# Altium schematic sheet SD_CARD_SDIO.SchDoc
size 209 x 297 mm; SheetNumber: 19; SheetTotal: 23
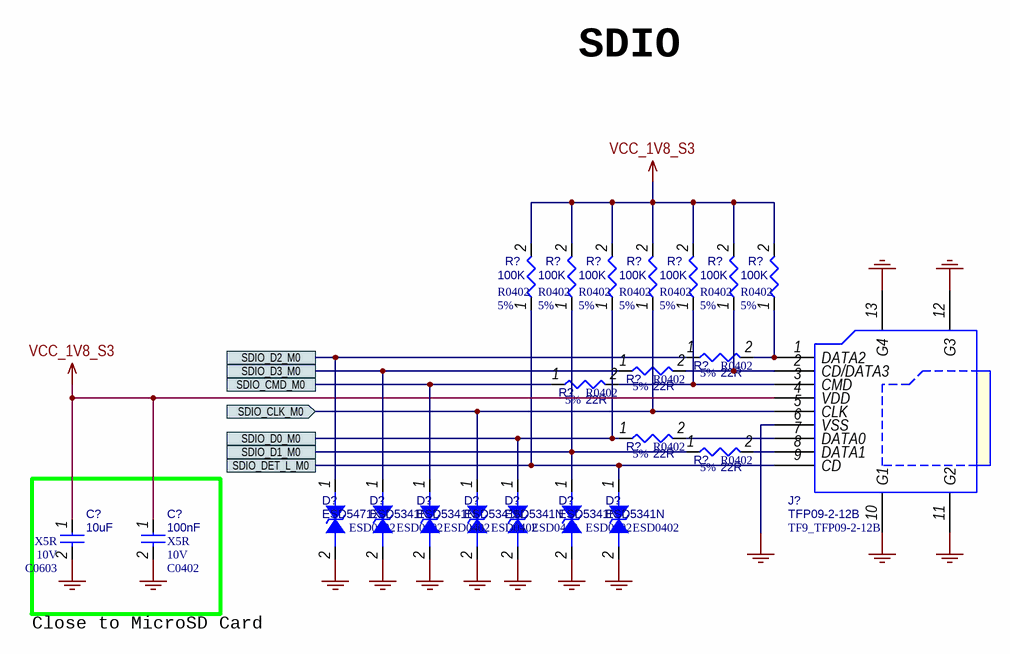
[diagram p0: SD_CARD_SDIO.SchDoc]

## Parts
(Parts that share a designator on the sheet are numbered #1, #2 ... from top to bottom, then left to right.)
C?#1  10uF  Dielectric: X5R  Voltage: 10V  [C0603]
C?#2  100nF  Dielectric: X5R  Voltage: 10V  [C0402]
D?#1  ESD5471X  [ESD0402]
D?#2  ESD5341N  [ESD0402]
D?#3  ESD5341N  [ESD0402]
D?#4  ESD5341N  [ESD0402]
D?#5  ESD5341N  [ESD0402]
D?#6  ESD5341N  [ESD0402]
D?#7  ESD5341N  [ESD0402]
J?  TFP09-2-12B  PCB Footprint: TF9_TFP09-2-12B  [TF-CKT01-009D]
R?#1  100K  Tolerance: 5%  [R0402]
R?#2  100K  Tolerance: 5%  [R0402]
R?#3  100K  Tolerance: 5%  [R0402]
R?#4  100K  Tolerance: 5%  [R0402]
R?#5  100K  Tolerance: 5%  [R0402]
R?#6  100K  Tolerance: 5%  [R0402]
R?#7  100K  Tolerance: 5%  [R0402]
R?#8  22R  Tolerance: 5%  [R0402]
R?#9  22R  Tolerance: 5%  [R0402]
R?#10  22R  Tolerance: 5%  [R0402]
R?#11  22R  Tolerance: 5%  [R0402]
R?#12  22R  Tolerance: 5%  [R0402]

## Ports
SDIO_CLK_M0 (in, see RK3588_BOOTLOADER_MAYBE_SDIO[2C]), SDIO_CMD_M0 (see RK3588_BOOTLOADER_MAYBE_SDIO[2C]), SDIO_D0_M0 (see RK3588_BOOTLOADER_MAYBE_SDIO[2C]), SDIO_D1_M0 (see RK3588_BOOTLOADER_MAYBE_SDIO[2C]), SDIO_D2_M0 (see RK3588_BOOTLOADER_MAYBE_SDIO[2C]), SDIO_D3_M0 (see RK3588_BOOTLOADER_MAYBE_SDIO[2C]), SDIO_DET_L_M0 (see RK3588_BOOTLOADER_MAYBE_SDIO[2C])

## Nets
GND: C?#1.2 C?#2.2 D?#1.2 D?#2.2 D?#3.2 D?#4.2 D?#5.2 D?#6.2 D?#7.2 J?.6(VSS) J?.10(G1) J?.11(G2) J?.12(G3) J?.13(G4)
VCC_1V8_S3: C?#1.1 C?#2.1 J?.4(VDD) R?#1.2 R?#2.2 R?#3.2 R?#4.2 R?#5.2 R?#6.2 R?#7.2
SDIO_CLK_M0: D?#4.1 J?.5(CLK) R?#4.1 ; port SDIO_CLK_M0
SDIO_CMD_M0: D?#3.1 R?#10.1 ; port SDIO_CMD_M0
SDIO_D0_M0: D?#5.1 R?#3.1 R?#11.1 ; port SDIO_D0_M0
SDIO_D1_M0: D?#6.1 R?#2.1 R?#12.1 ; port SDIO_D1_M0
SDIO_D2_M0: D?#1.1 R?#8.1 ; port SDIO_D2_M0
SDIO_D3_M0: D?#2.1 R?#9.1 ; port SDIO_D3_M0
SDIO_DET_L_M0: D?#7.1 J?.9(CD) R?#1.1 ; port SDIO_DET_L_M0
NetJ?_1: J?.1(DATA2) R?#7.1 R?#8.2
NetJ?_2: J?.2(CD/DATA3) R?#6.1 R?#9.2
NetJ?_3: J?.3(CMD) R?#5.1 R?#10.2
NetJ?_7: J?.7(DATA0) R?#11.2
NetJ?_8: J?.8(DATA1) R?#12.2

## Notes on the sheet
- SDIO
- Close to MicroSD Card
- 297x210
- Формат А4

## Library data of the parts
C?#1 = CAP NP_Dup1: cap,10.00uF,+/-10%,10V,X5R,C0603; Part Reference: C4201; Manufacturer PN: C1608X5R1A106K080AC; Manufacturer: TDK; Tolerance: 10%; C_Voltage: 6.3V; Priority: A; PCB Footprint: C0603; Value: 10uF; Created by: JJJ; Part Type: C0603; RK PN: C1608X5R1A106K080AC
C?#2 = CAP NP_Dup1: cap,100.00nF,+/-10%,10V,X5R,C0402; Part Reference: C4202; Manufacturer PN: C1005X5R1A104K050BA; Manufacturer: TDK; C_Voltage: 6.3V; Tolerance: 10%; Priority: A; Number: 37; PCB Footprint: C0402; Value: 100nF; Created by: JJJ; Part Type: C0402; RK PN: C1005X5R1A104K050BA
D?#1 = DIODE BI_DIR TRIG: 1-Line, Bi-directional, Transient Voltage Suppressors.9pF.; Part Reference: D4201; Manufacturer: WillSemi(О¤¶ы°лµјМе); Priority: A; PCB Footprint: ESD0402; Value: ESD5471X; Created by: JJJ; Manufacturer PN: ESD5471X; Part Type: ESD_TVS; RK PN: ESD5471X
D?#2 = DIODE BI_DIR TRIG: 1-Line, Bi-directional, Transient Voltage Suppressors.1pF.; Part Reference: D4202; Manufacturer: WillSemi(О¤¶ы°лµјМе); Priority: A; PCB Footprint: ESD0402; Value: ESD5341N; Created by: JJJ; Manufacturer PN: ESD5341N; Part Type: ESD_TVS; RK PN: ESD5341N
D?#3 = DIODE BI_DIR TRIG: 1-Line, Bi-directional, Transient Voltage Suppressors.1pF.; Part Reference: D4203; Manufacturer: WillSemi(О¤¶ы°лµјМе); Priority: A; PCB Footprint: ESD0402; Value: ESD5341N; Created by: JJJ; Manufacturer PN: ESD5341N; Part Type: ESD_TVS; RK PN: ESD5341N
D?#4 = DIODE BI_DIR TRIG: 1-Line, Bi-directional, Transient Voltage Suppressors.1pF.; Part Reference: D4204; Manufacturer: WillSemi(О¤¶ы°лµјМе); Priority: A; PCB Footprint: ESD0402; Value: ESD5341N; RK PN: ESD5341N; Part Type: ESD_TVS; Manufacturer PN: ESD5341N; Created by: JJJ
D?#5 = DIODE BI_DIR TRIG: 1-Line, Bi-directional, Transient Voltage Suppressors.1pF.; Part Reference: D4205; Manufacturer: WillSemi(О¤¶ы°лµјМе); Priority: A; PCB Footprint: ESD0402; Value: ESD5341N; RK PN: ESD5341N; Part Type: ESD_TVS; Manufacturer PN: ESD5341N; Created by: JJJ
D?#6 = DIODE BI_DIR TRIG: 1-Line, Bi-directional, Transient Voltage Suppressors.1pF.; Part Reference: D4206; Manufacturer: WillSemi(О¤¶ы°лµјМе); Priority: A; PCB Footprint: ESD0402; Value: ESD5341N; RK PN: ESD5341N; Part Type: ESD_TVS; Manufacturer PN: ESD5341N; Created by: JJJ
D?#7 = DIODE BI_DIR TRIG: 1-Line, Bi-directional, Transient Voltage Suppressors.1pF.; Part Reference: D4207; Manufacturer: WillSemi(О¤¶ы°лµјМе); Priority: A; PCB Footprint: ESD0402; Value: ESD5341N; RK PN: ESD5341N; Part Type: ESD_TVS; Manufacturer PN: ESD5341N; Created by: JJJ
J? = TFCARD_SOCKET: НЁУГTFїЁЧщЈ¬И«іЯґз; Part Reference: J4200; Manufacturer: НъїЖґп; Priority: A; Value: TFP09-2-12B; Created by: JJJ; Manufacturer Part Number: TFP09-2-12B; Part Type: CARD Jack; RK PN: TFP09-2-12B
R?#1-R?#7 = RESISTOR_Dup2: НЁУГєсД¤µзЧи,100K,+/-5%,R0402,1/16W.; Part Reference: R4203; Manufacturer: YAGEO; RK PN: RC0402JR-07100KL; Priority: A; Wattage: 1/16W; PCB Footprint: R0402; Value: 100K; Part Type: НЁУГєсД¤µзЧи; Manufacturer PN: RC0402JR-07100KL; Created by: YTL
R?#8-R?#12 = RESISTOR_Dup2: НЁУГєсД¤µзЧи,22R,+/-5%,R0402,1/16W.; Part Reference: R1320; Manufacturer PN: RC0402JR-0722RL; Manufacturer: YAGEO; Wattage: 1/16W; Priority: A; PCB Footprint: R0402; Value: 22R; Created by: YTL; Part Type: НЁУГєсД¤µзЧи; RK PN: RC0402JR-0722RL